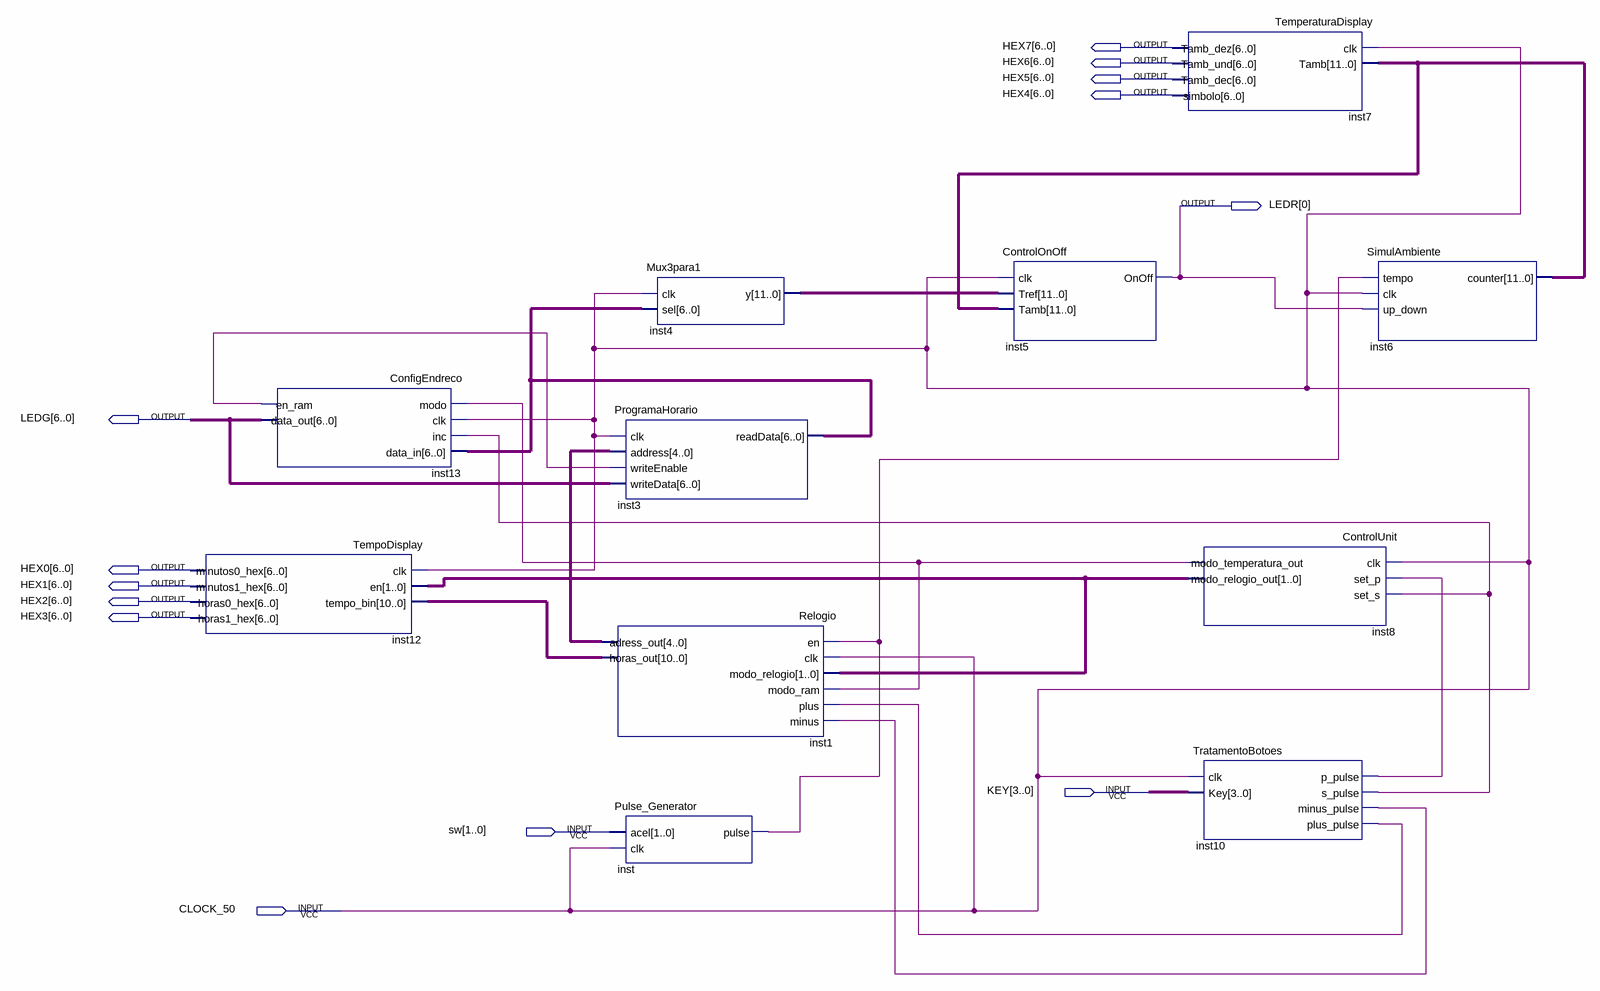
[diagram p0: schematic sheet]
// Quartus schematic ControloRadiador_bdf.bdf as structural Verilog: 11 symbols, 13 pins
module ControloRadiador_bdf (
  input  [3:0] KEY,
  input  [1:0] sw,
  input  CLOCK_50,
  output [6:0] HEX7,
  output [6:0] HEX6,
  output [6:0] HEX5,
  output [6:0] HEX4,
  output [0:0] LEDR,
  output [6:0] LEDG,
  output [6:0] HEX0,
  output [6:0] HEX1,
  output [6:0] HEX2,
  output [6:0] HEX3
);

  wire inst8_modo_temperatura_out, inst10_minus_pulse, inst10_p_pulse, inst10_plus_pulse, inst10_s_pulse,
       inst13_en_ram, inst_pulse;
  wire [1:0] inst8_modo_relogio_out;
  wire [4:0] inst1_adress_out;
  wire [6:0] inst3_readdata;
  wire [10:0] inst1_horas_out;
  wire [11:0] inst4_y, inst6_counter;

  TempoDisplay inst12 (
    .clk(CLOCK_50), .en(inst8_modo_relogio_out), .tempo_bin(inst1_horas_out), .minutos0_hex(HEX0),
    .minutos1_hex(HEX1), .horas0_hex(HEX2), .horas1_hex(HEX3));
  ConfigEndreco inst13 (
    .modo(inst8_modo_temperatura_out), .clk(CLOCK_50), .inc(inst10_s_pulse), .data_in(inst3_readdata),
    .en_ram(inst13_en_ram), .data_out(LEDG));
  ProgramaHorario inst3 (
    .clk(CLOCK_50), .address(inst1_adress_out), .writeEnable(inst13_en_ram), .writeData(LEDG),
    .readData(inst3_readdata));
  Relogio inst1 (
    .en(inst_pulse), .clk(CLOCK_50), .modo_relogio(inst8_modo_relogio_out),
    .modo_ram(inst8_modo_temperatura_out), .plus(inst10_plus_pulse), .minus(inst10_minus_pulse),
    .adress_out(inst1_adress_out), .horas_out(inst1_horas_out));
  Pulse_Generator inst (.acel(sw), .clk(CLOCK_50), .pulse(inst_pulse));
  Mux3para1 inst4 (.clk(CLOCK_50), .sel(inst3_readdata), .y(inst4_y));
  ControlOnOff inst5 (.clk(CLOCK_50), .Tref(inst4_y), .Tamb(inst6_counter), .OnOff(LEDR[0]));
  TemperaturaDisplay inst7 (
    .clk(CLOCK_50), .Tamb(inst6_counter), .Tamb_dez(HEX7), .Tamb_und(HEX6), .Tamb_dec(HEX5), .simbolo(HEX4));
  ControlUnit inst8 (
    .clk(CLOCK_50), .set_p(inst10_p_pulse), .set_s(inst10_s_pulse),
    .modo_temperatura_out(inst8_modo_temperatura_out), .modo_relogio_out(inst8_modo_relogio_out));
  TratamentoBotoes inst10 (
    .clk(CLOCK_50), .Key(KEY), .p_pulse(inst10_p_pulse), .s_pulse(inst10_s_pulse),
    .minus_pulse(inst10_minus_pulse), .plus_pulse(inst10_plus_pulse));
  SimulAmbiente inst6 (.tempo(inst_pulse), .clk(CLOCK_50), .up_down(LEDR[0]), .counter(inst6_counter));
endmodule
